# Altium project AUDIO_cape.PrjPCB
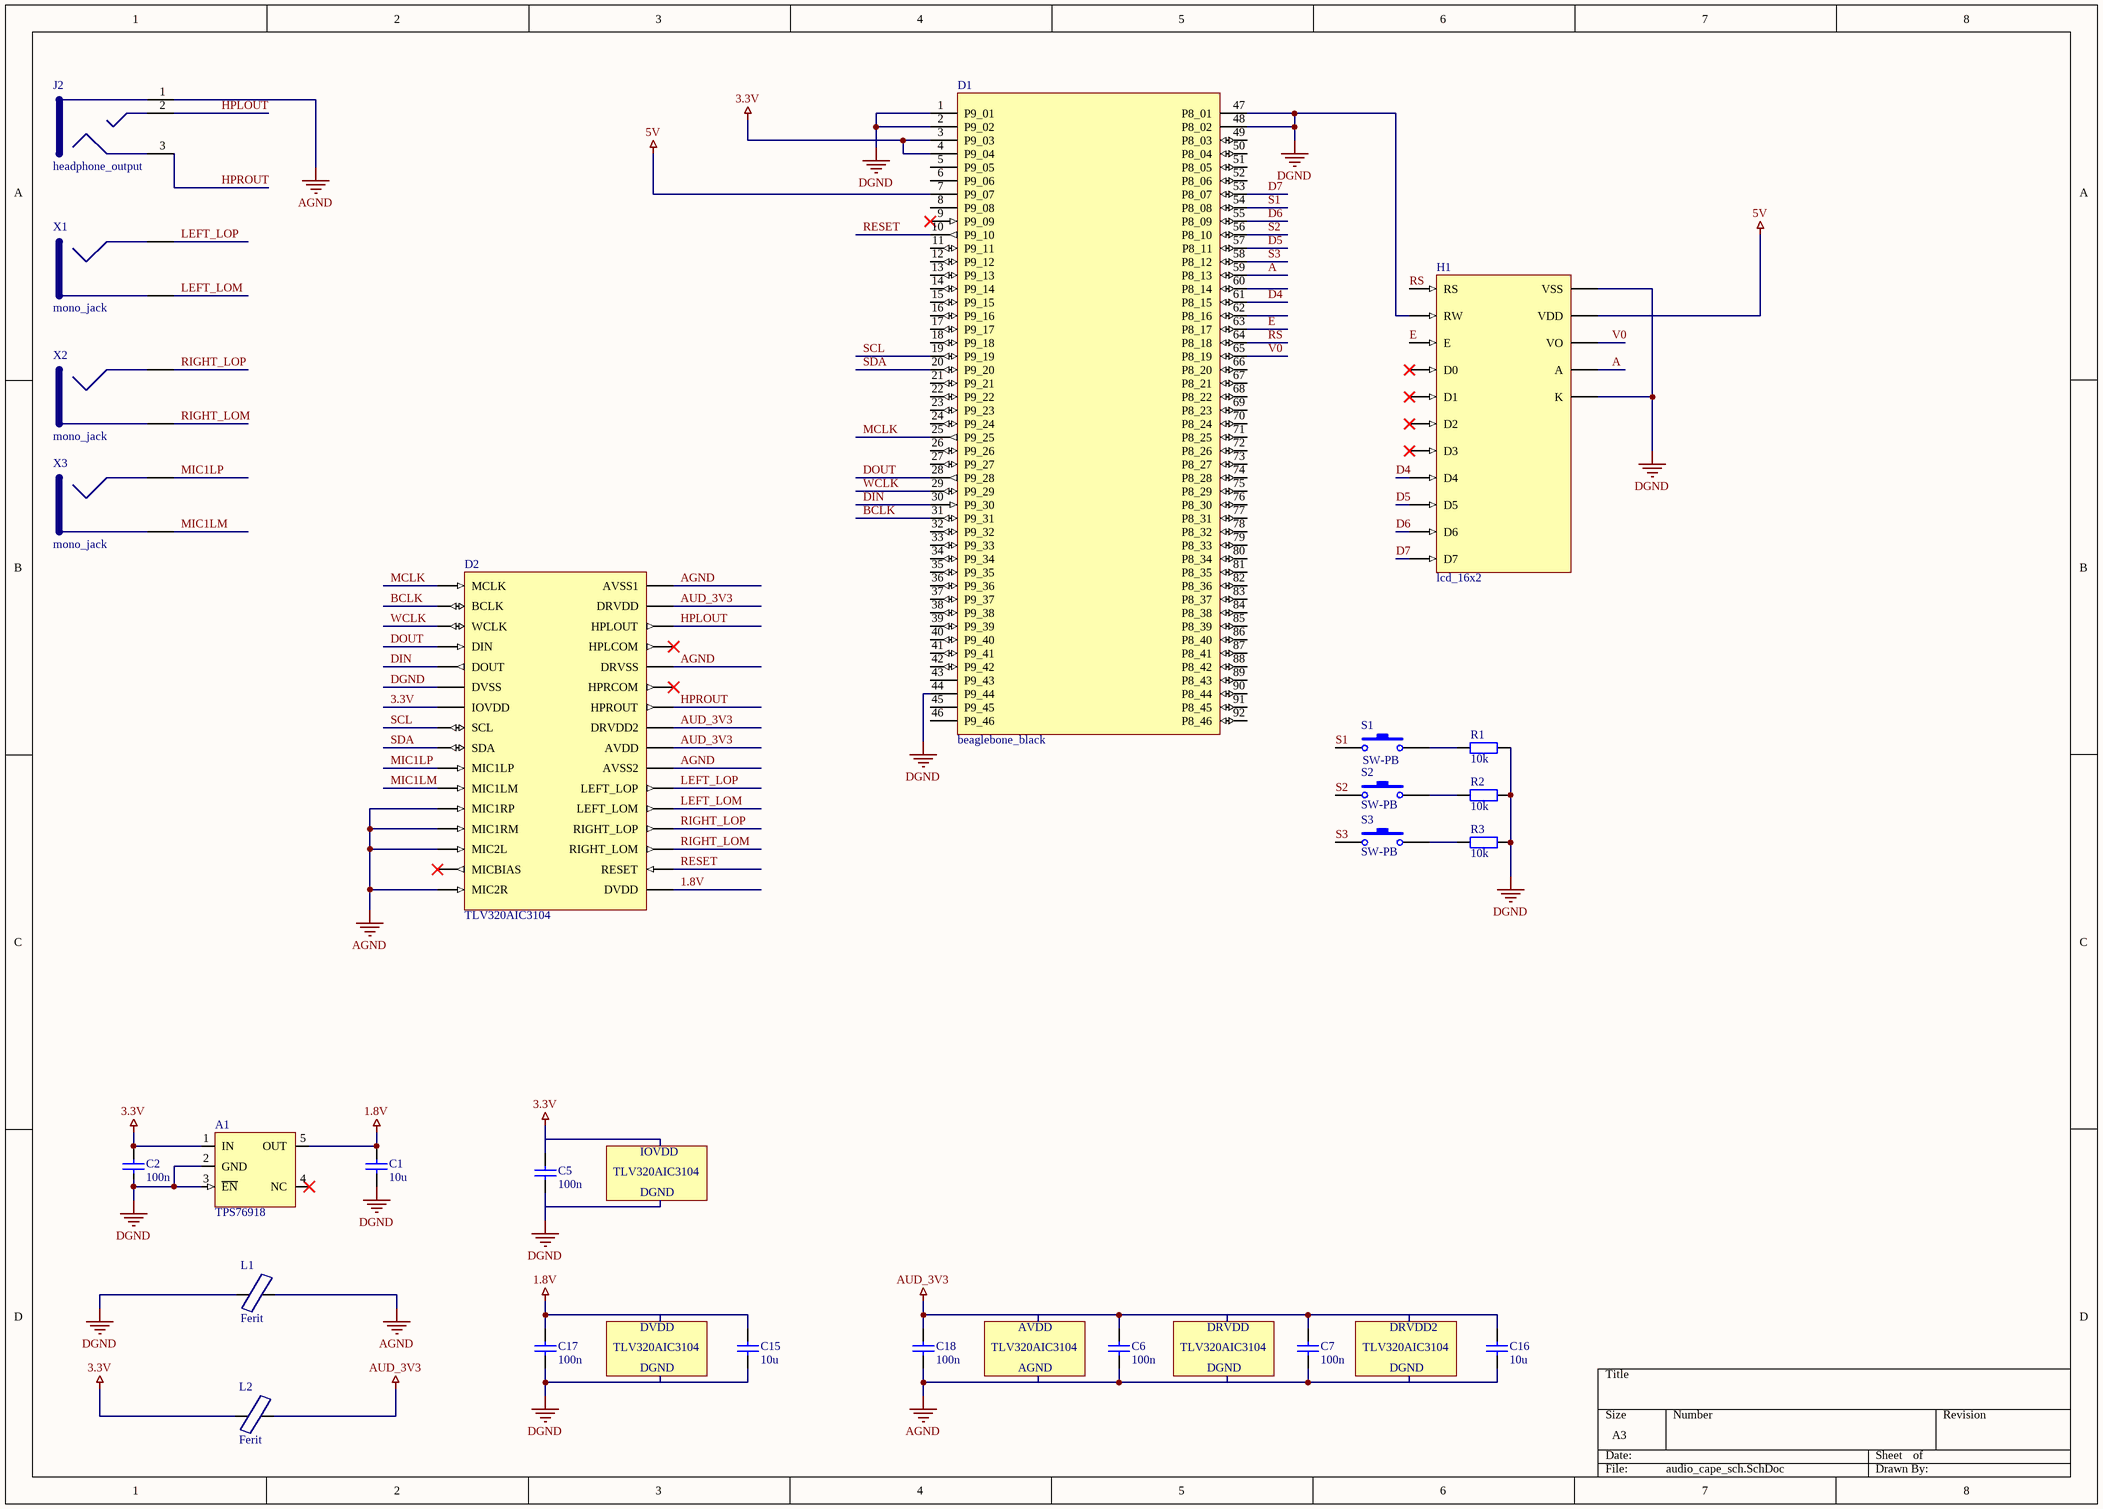
[diagram p0: audio_cape_sch.SchDoc]
1 sheet, 25 parts. Net scope: global (net labels, ports and power ports of the same name join across sheets).
Board file: audio_cape_pcb.PcbDoc

## Sheet audio_cape_sch.SchDoc
size A3

### Parts
A1  TPS76918  [DBV005]
C1  10u  [6-0805_N]
C2  100n  [6-0805_N]
C5  100n  [6-0805_N]
C6  100n  [6-0805_N]
C7  100n  [6-0805_N]
C15  10u  [6-0805_N]
C16  10u  [6-0805_N]
C17  100n  [6-0805_N]
C18  100n  [6-0805_N]
D1  beaglebone_black  [BBB_Cape]
D2  TLV320AIC3104  [QUAD32-RHB]
H1  lcd_16x2  [SIP16]
J2  headphone_output  [STEZALJKA_3P_5MM]
L1  Ferit  [6-0805_N]
L2  Ferit  [6-0805_N]
R1  10k  [6-0805_M]
R2  10k  [6-0805_M]
R3  10k  [6-0805_M]
S1  SW-PB  [STEZALJKA_2P_5MM]
S2  SW-PB  [STEZALJKA_2P_5MM]
S3  SW-PB  [STEZALJKA_2P_5MM]
X1  mono_jack  [STEZALJKA_2P_5MM]
X2  mono_jack  [STEZALJKA_2P_5MM]
X3  mono_jack  [STEZALJKA_2P_5MM]

### Nets
1.8V: A1.5(OUT) C1.2 C15.2 C17.2 D2.32(DVDD)
3.3V: A1.1(IN) C2.2 C5.2 D1.3(P9_03) D1.4(P9_04) D2.7(IOVDD) L2.1
5V: D1.7(P9_07) H1.2(VDD)
AGND: C6.1 C7.1 C16.1 C18.1 D2.12(MIC1RP) D2.13(MIC1RM) D2.14(MIC2L) D2.16(MIC2R) D2.17(AVSS1) D2.21(DRVSS) D2.26(AVSS2) D2.33(THERMAL_PAD) J2.1(GND) L1.2
AUD_3V3: C6.2 C7.2 C16.2 C18.2 D2.18(DRVDD) D2.24(DRVDD2) D2.25(AVDD) L2.2
DGND: A1.2(GND) A1.3(~{EN}) C1.1 C2.1 C5.1 C15.1 C17.1 D1.1(P9_01) D1.2(P9_02) D1.44(P9_44) D1.47(P8_01) D1.48(P8_02) D2.6(DVSS) H1.1(VSS) H1.5(RW) H1.16(K) L1.1 R1.2 R2.2 R3.2
A: D1.59(P8_13) H1.15(A)
BCLK: D1.31(P9_31) D2.2(BCLK)
D4: D1.61(P8_15) H1.11(D4)
D5: D1.57(P8_11) H1.12(D5)
D6: D1.55(P8_09) H1.13(D6)
D7: D1.53(P8_07) H1.14(D7)
DIN: D1.30(P9_30) D2.5(DOUT)
DOUT: D1.28(P9_28) D2.4(DIN)
E: D1.63(P8_17) H1.6(E)
HPLOUT: D2.19(HPLOUT) J2.2(RIGHT)
HPROUT: D2.23(HPROUT) J2.3(LEFT)
LEFT_LOM: D2.28(LEFT_LOM) X1.2
LEFT_LOP: D2.27(LEFT_LOP) X1.1(GND)
MCLK: D1.25(P9_25) D2.1(MCLK)
MIC1LM: D2.11(MIC1LM) X3.2
MIC1LP: D2.10(MIC1LP) X3.1(GND)
RESET: D1.10(P9_10) D2.31(RESET)
RIGHT_LOM: D2.30(RIGHT_LOM) X2.2
RIGHT_LOP: D2.29(RIGHT_LOP) X2.1(GND)
RS: D1.64(P8_18) H1.4(RS)
S1: D1.54(P8_08) S1.1
S2: D1.56(P8_10) S2.1
S3: D1.58(P8_12) S3.1
SCL: D1.19(P9_19) D2.8(SCL)
SDA: D1.20(P9_20) D2.9(SDA)
V0: D1.65(P8_19) H1.3(VO)
WCLK: D1.29(P9_29) D2.3(WCLK)
NetR1_1: R1.1 S1.2
NetR2_1: R2.1 S2.2
NetR3_1: R3.1 S3.2

Not connected (* = marked no-connect by the designer): A1 4(NC)*; D1 5(P9_05) 6(P9_06) 8(P9_08) 9(P9_09)* 11(P9_11) 12(P9_12) 13(P9_13) 14(P9_14) 15(P9_15) 16(P9_16) 17(P9_17) 18(P9_18) 21(P9_21) 22(P9_22) 23(P9_23) 24(P9_24) 26(P9_26) 27(P9_27) 32(P9_32) 33(P9_33) 34(P9_34) 35(P9_35) 36(P9_36) 37(P9_37) 38(P9_38) 39(P9_39) 40(P9_40) 41(P9_41) 42(P9_42) 43(P9_43) 45(P9_45) 46(P9_46) 49(P8_03) 50(P8_04) 51(P8_05) 52(P8_06) 60(P8_14) 62(P8_16) 66(P8_20) 67(P8_21) 68(P8_22) 69(P8_23) 70(P8_24) 71(P8_25) 72(P8_26) 73(P8_27) 74(P8_28) 75(P8_29) 76(P8_30) 77(P8_31) 78(P8_32) 79(P8_33) 80(P8_34) 81(P8_35) 82(P8_36) 83(P8_37) 84(P8_38) 85(P8_39) 86(P8_40) 87(P8_41) 88(P8_42) 89(P8_43) 90(P8_44) 91(P8_45) 92(P8_46); D2 15(MICBIAS)* 20(HPLCOM)* 22(HPRCOM)*; H1 7(D0)* 8(D1)* 9(D2)* 10(D3)*

### Notes on the sheet
- TLV320AIC3104
- IOVDD
- DGND
- DVDD
- AVDD
- AGND
- DRVDD
- DRVDD2

### Library data of the parts
A1 = TPS76918: LDO regulator napona; Cijena: 11.28; Dobavljač: Farnell; Kataloški broj: 8461503
C1 C2 C5-C7 C15-C18 = Cap: Keramički kondezator; Cijena: 0.41; Dobavljač: Farnell; Kataloški broj: 3019949
D2 = TLV320AIC3104: Cijena: 0.00; Dobavljač: Texas Instruments; Kataloški broj: TLV320AIC3104IRHBT
H1 = lcd_16x2: 16x2 LCD prikaznik
J2 = audio_connector: Priključak za slušalice; Cijena: 2.20; Dobavljač: Chipoteka; Kataloški broj: 2630504415
L1 L2 = FerriteBead: Feritna jezgra; Cijena: 1.31; Dobavljač: Farnell; Kataloški broj: 1635735
R1-R3 = Res2: Resistor; Cijena: 0.17; Dobavljač: Farnell; Kataloški broj: 9332391
S1-S3 = SW-PB: Prekidač-pritisni; Cijena: 1.67; Dobavljač: Chipoteka; Kataloški broj: 2630505010
X1-X3 = mono_jack: Mono audio input; Cijena: 1.67; Dobavljač: Chipoteka; Kataloški broj: 2630505010